# EAGLE schematic pocket_avr_programmer_to_attiny_x4 (EAGLE 9.2.2)
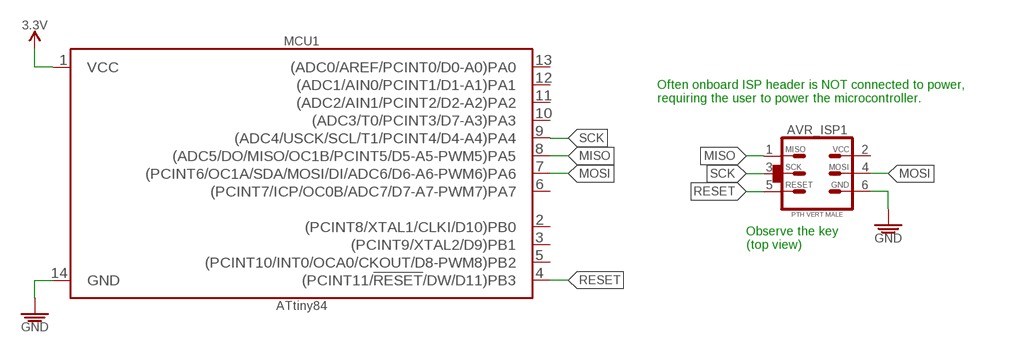
[diagram p0: schematic, sheet 1]

## Parts
AVR_ISP1  PTH VERT MALE  AVR_SPI_PRG_6_PTH_VERT_MALE_2.54MM  [HDRV6W64P254_2X3_762X483X838B_AVR-ISP]
MCU1  ATtiny84  ATTINY-X4_DIP-14_ATTINY-84  [DIP793W45P254L1919H533Q14B_DIP-14_ATTINY-X4]

## Nets
3.3V: MCU1.1(VCC)
GND: AVR_ISP1.GND MCU1.14(GND)
MISO: AVR_ISP1.MISO MCU1.8((ADC5/DO/MISO/OC1B/PCINT5/D5-A5-PWM5)PA5)
MOSI: AVR_ISP1.MOSI MCU1.7((PCINT6/OC1A/SDA/MOSI/DI/ADC6/D6-A6-PWM6)PA6)
RESET: AVR_ISP1.RESET MCU1.4((PCINT11/!RESET!/DW/D11)PB3)
SCK: AVR_ISP1.SCK MCU1.9((ADC4/USCK/SCL/T1/PCINT4/D4-A4)PA4)
Unconnected: AVR_ISP1.VCC MCU1.2((PCINT8/XTAL1/CLKI/D10)PB0) MCU1.3((PCINT9/XTAL2/D9)PB1) MCU1.5((PCINT10/INT0/OCA0/CKOUT/D8-PWM8)PB2) MCU1.6((PCINT7/ICP/OC0B/ADC7/D7-A7-PWM7)PA7) MCU1.10((ADC3/T0/PCINT3/D7-A3)PA3) MCU1.11((ADC2/AIN1/PCINT2/D2-A2)PA2) MCU1.12((ADC1/AIN0/PCINT1/D1-A1)PA1) MCU1.13((ADC0/AREF/PCINT0/D0-A0)PA0)

## Notes on the sheet
- Often onboard ISP header is NOT connected to power,
  requiring the user to power the microcontroller.
- Observe the key
  (top view)

## Library data of the parts
AVR_ISP1 = PiB_connectors:AVR_SPI_PRG_6: AVR ISP 6 Pin This is the reduced ISP connector for AVR programming. Common on Arduino. This footprint will take up less PCB space and can be used with a 10-pin to 6-pin adapter such as SKU: BOB-08508; DATASHEET: https://cdn.amphenol-icc.com/media/wysiwyg/files/drawing/67996.pdf; DIST: Digikey; DISTLINK: https://www.digikey.com/products/en?keywords=609-3234-ND; DISTPN: 609-3234-ND; MFR: Amphenol FCI; MPN: 67997-206HLF
MCU1 = PiB_ic_microcontrollers:ATTINY-X4; DATASHEET: http://www.microchip.com/mymicrochip/filehandler.aspx?ddocname=en590190; DIST: Digikey; DISTLINK: https://www.digikey.com/products/en?keywords=ATTINY84A-PU-ND; DISTPN: ATTINY84A-PU-ND; MFR: Microchip Technology; MPN: ATTINY84A-PU